# EAGLE design untitled (EAGLE 7.1.0)
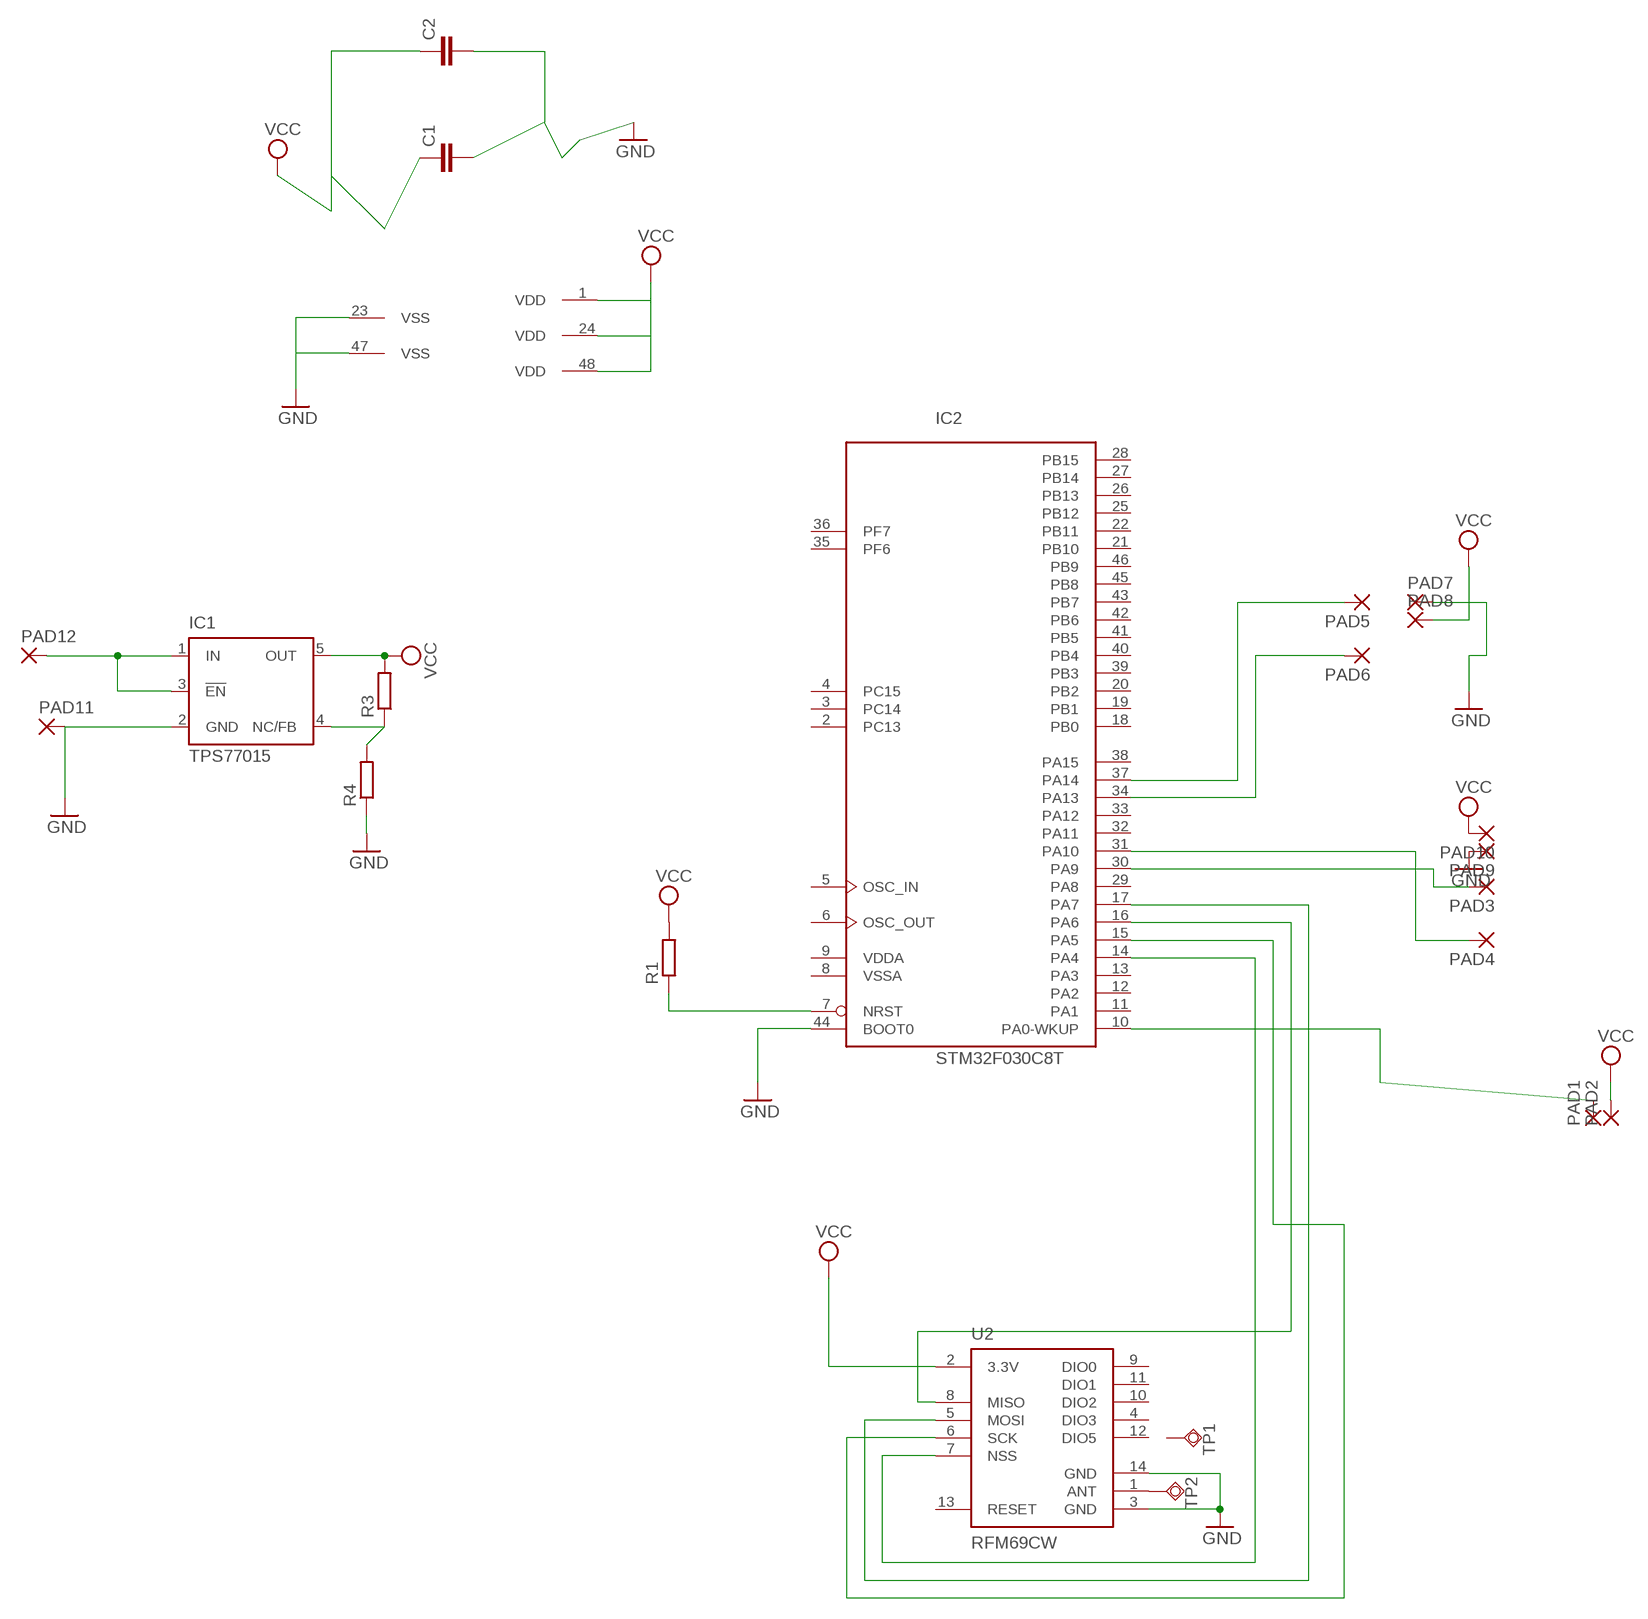
[diagram p0: schematic, sheet 1]

## Parts
C1  C-EUC1206  [C1206]
C2  C-EUC1206  [C1206]
IC1  TPS77015  [SOT23-DBV]
IC2  STM32F030C8T  [LQFP48]
PAD1  SMD2  [SMD1,27-2,54]
PAD2  SMD2  [SMD1,27-2,54]
PAD3  SMD2  [SMD1,27-2,54]
PAD4  SMD2  [SMD1,27-2,54]
PAD5  SMD2  [SMD1,27-2,54]
PAD6  SMD2  [SMD1,27-2,54]
PAD7  SMD2  [SMD1,27-2,54]
PAD8  SMD2  [SMD1,27-2,54]
PAD9  SMD2  [SMD1,27-2,54]
PAD10  SMD2  [SMD1,27-2,54]
PAD11  SMD2  [SMD1,27-2,54]
PAD12  SMD2  [SMD1,27-2,54]
R1  R-EU_M1206  [M1206]
R3  R-EU_M0805  [M0805]
R4  R-EU_M0805  [M0805]
TP1  TPSQTP20SQ  [TP20SQ]
TP2  TPSQTP20SQ  [TP20SQ]
U2  RFM69CW  [RFM69CW-XXXS2]

## Nets
GND: C1.2 C2.2 IC1.2(GND) IC2.23(VSS) IC2.44(BOOT0) IC2.47(VSS) PAD7.1(P) PAD9.1(P) PAD11.1(P) R4.1 U2.3(GND) U2.14(GND)
N$1: IC2.7(NRST) R1.1
N$2: IC2.37(PA14) PAD5.1(P)
N$3: IC2.16(PA6) U2.8(MISO)
N$4: IC2.14(PA4) U2.7(NSS)
N$5: TP2.TP U2.1(ANT)
N$6: IC2.17(PA7) U2.5(MOSI)
N$7: IC2.34(PA13) PAD6.1(P)
N$8: IC2.30(PA9) PAD3.1(P)
N$9: IC2.31(PA10) PAD4.1(P)
N$11: IC2.10(PA0-WKUP) PAD1.1(P)
N$12: IC1.1(IN) IC1.3(!EN) PAD12.1(P)
N$13: IC2.15(PA5) U2.6(SCK)
N$14: IC1.4(NC/FB) R3.1 R4.2
VCC: C1.1 C2.1 IC1.5(OUT) IC2.1(VDD) IC2.24(VDD) IC2.48(VDD) PAD2.1(P) PAD8.1(P) PAD10.1(P) R1.2 R3.2 U2.2(3.3V)
Unconnected: IC2.2(PC13) IC2.3(PC14) IC2.4(PC15) IC2.5(OSC_IN) IC2.6(OSC_OUT) IC2.11(PA1) IC2.12(PA2) IC2.13(PA3) IC2.18(PB0) IC2.19(PB1) IC2.20(PB2) IC2.21(PB10) IC2.22(PB11) IC2.25(PB12) IC2.26(PB13) IC2.27(PB14) IC2.28(PB15) IC2.29(PA8) IC2.32(PA11) IC2.33(PA12) IC2.35(PF6) IC2.36(PF7) IC2.38(PA15) IC2.39(PB3) IC2.40(PB4) IC2.41(PB5) IC2.42(PB6) IC2.43(PB7) IC2.45(PB8) IC2.46(PB9) TP1.TP U2.4(DIO3) U2.9(DIO0) U2.10(DIO2) U2.11(DIO1) U2.12(DIO5) U2.13(RESET)

## Power pins joined to a net without a drawn wire
VDDA: IC2.9(VDDA)
VSSA: IC2.8(VSSA)

## Library data of the parts
C1 C2 = rcl:C-EU: CAPACITOR, European symbol
IC1 = texas:TPS770*: ULTRALOW-POWER 50-mA LOW-DROPOUT LINEAR REGULATORS 50-mA Low-Dropout Regulator Source: http://focus.ti.com/lit/ds/symlink/tps77001.pdf; MF: TEXAS INSTRUMENT CONNECTORS; MPN: TPS77015DBVT; OC_FARNELL: 1412879; OC_NEWARK: 77C1175
IC2 = micro-stm_v2:STM32F030C*T: ARM 32-bit Cortex™-M0 CPU 48 MHz maximum frequency 32 to 64 Kbytes of Flash memory 4 to 8 kbytes of SRAM 39 GPIOs 2.4 to 3.6 V application supply
PAD1-PAD12 = wirepad:SMD2: SMD PAD
R1 R3 R4 = rcl:R-EU_: RESISTOR, European symbol
TP1 TP2 = testpad:TPSQ: Test pad
U2 = mike-temp:RFM69

## Board
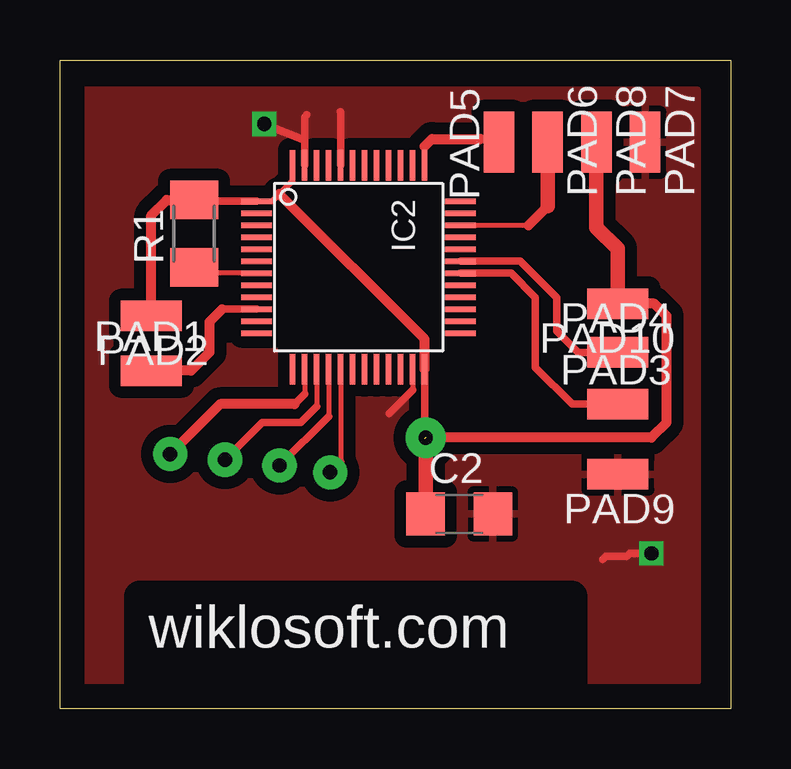
[diagram p1: board, top side]
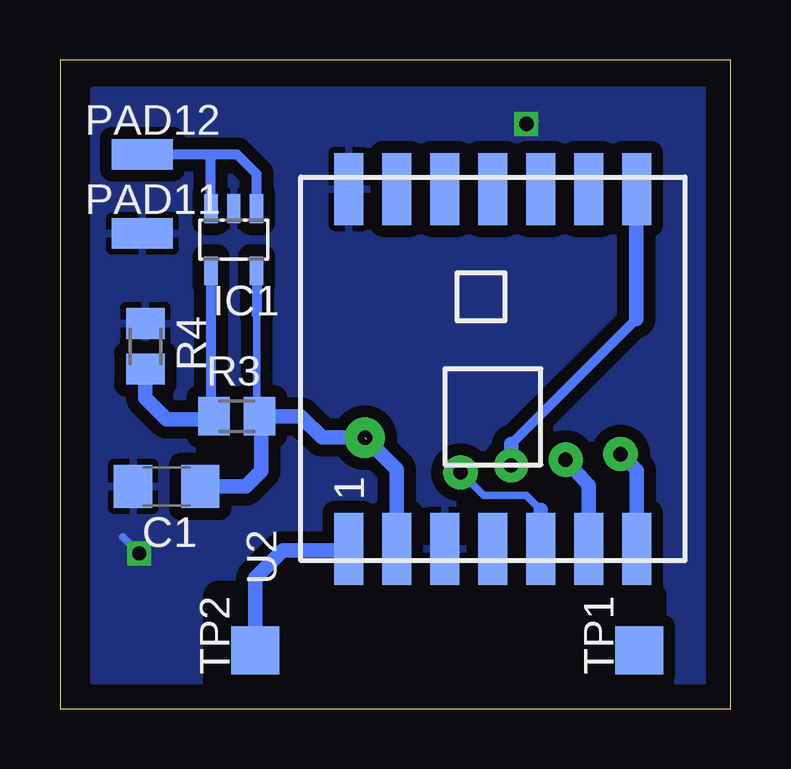
[diagram p2: board, bottom side, seen from below]

Size 27.94 x 27.05 mm. Coordinates in mm from the lower left corner, seen from the top.
Outline: 0,27.05 27.94,27.05 27.94,0 0,0 0,27.05
Copper layers (1*16): Top 0.035mm / dielectric 1.5mm / Bottom 0.035mm
Design rules "default": minimum track width 10mil, minimum drill 24mil, track to track 8mil, track to pad 8mil, pad to pad 8mil, via to via 8mil, smd to smd 8mil, copper to edge 40mil, drill to drill 8mil, minimum pad ring 10mil, minimum via ring 8mil, stop-mask expansion 4mil, vias tented up to drill 0mil, thermal gap 10mil
tRestrict: area 3.3,1.2 to 21.3,4.7
bRestrict: area 3.3,1.2 to 21.3,4.7

### Footprints (pad centres in the part's own frame; a part is rotated, then mirrored left to right if it is on the bottom)
C1206 = smd 1.6 x 1.8: 1 -1.4,0; 2 1.4,0
SOT23-DBV = smd 0.55 x 1.2: 1 -0.95,-1.3; 2 0,-1.3; 3 0.95,-1.3; 4 0.95,1.3; 5 -0.95,1.3
LQFP48 = smd 0.229 x 1.27: 1 -2.75,-4.25; 2 -2.25,-4.25; 3 -1.75,-4.25; 4 -1.25,-4.25; 5 -0.75,-4.25; 6 -0.25,-4.25; 7 0.25,-4.25; 8 0.75,-4.25; 9 1.25,-4.25; 10 1.75,-4.25; 11 2.25,-4.25; 12 2.75,-4.25; 25 2.75,4.25; 26 2.25,4.25; 27 1.75,4.25; 28 1.25,4.25; 29 0.75,4.25; 30 0.25,4.25; 31 -0.25,4.25; 32 -0.75,4.25; 33 -1.25,4.25; 34 -1.75,4.25; 35 -2.25,4.25; 36 -2.75,4.25 | smd 1.27 x 0.229: 13 4.25,-2.75; 14 4.25,-2.25; 15 4.25,-1.75; 16 4.25,-1.25; 17 4.25,-0.75; 18 4.25,-0.25; 19 4.25,0.25; 20 4.25,0.75; 21 4.25,1.25; 22 4.25,1.75; 23 4.25,2.25; 24 4.25,2.75; 37 -4.25,2.75; 38 -4.25,2.25; 39 -4.25,1.75; 40 -4.25,1.25; 41 -4.25,0.75; 42 -4.25,0.25; 43 -4.25,-0.25; 44 -4.25,-0.75; 45 -4.25,-1.25; 46 -4.25,-1.75; 47 -4.25,-2.25; 48 -4.25,-2.75
SMD1,27-2,54 = smd 1.27 x 2.54: 1 0,0
M1206 = smd 1.6 x 2: 1 -1.4,0; 2 1.4,0
M0805 = smd 1.3 x 1.6: 1 -0.95,0; 2 0.95,0
TP20SQ = smd 2 x 2: TP 0,0
RFM69CW-XXXS2 = smd 3 x 1.2: 1 -7.5,6; 2 -7.5,4; 3 -7.5,2; 4 -7.5,0; 5 -7.5,-2; 6 -7.5,-4; 7 -7.5,-6; 8 7.5,-6; 9 7.5,-4; 10 7.5,-2; 11 7.5,0; 12 7.5,2; 13 7.5,4; 14 7.5,6

### Placement (x,y rotation side)
C1  23.5,9.27 180 bottom
C2  16.64,8.13 0 top
IC1  20.7,19.56 180 bottom
IC2  12.45,18.41 270 top
PAD1  3.81,14.1 270 top
PAD2  3.81,16.38 90 top
PAD3  23.24,12.7 270 top
PAD4  23.24,14.86 270 top
PAD5  18.29,23.62 0 top
PAD6  20.32,23.62 180 top
PAD7  24.38,23.62 180 top
PAD8  22.35,23.62 180 top
PAD9  23.24,9.78 90 top
PAD10  23.24,16.89 90 top
PAD11  24.51,19.81 270 bottom
PAD12  24.51,23.11 270 bottom
R1  5.59,19.81 90 top
R3  20.57,12.19 0 bottom
R4  24.38,15.11 270 bottom
TP1  3.81,2.43 90 bottom
TP2  19.81,2.43 90 bottom
U2  9.91,14.18 90 bottom

### Tracks (layer width: path | path; a pad name or v marks a point on that pad's centre or on a via)
GND  (via drill 0.6)
  Top 0.203: IC2.23 14.7,13.3
  Top 0.305: 14.7,13.3 13.72,12.32 | 10.2,23.71 v8.51,24.38 | v24.64,6.48 23.75,6.48 23.62,6.35 22.73,6.35 22.61,6.22 | IC2.47 10.2,24.67 10.29,24.77 | IC2.44 11.7,24.88 11.68,24.89
  Bottom 0.305: v8.51,24.38 8.13,24.51 | 25.33,7.17 v24.64,6.48
  pour Top (isolate 0.5): 1.02,25.78 1.02,1.14 26.54,1.14 26.54,25.78
  pour Bottom (isolate 0.5): 1.02,25.78 26.54,25.78 26.54,1.14 1.02,1.14
N$1
  Top 0.203: IC2.7 5.72,18.16
  Top 0.305: 5.72,18.16 R1.1
N$2
  Top 0.203: 17.97,22.66 PAD5.1 | IC2.37 15.2,23.45
  Top 0.305: 17.53,23.75 PAD5.1
  Top 0.406: 15.2,23.45 15.49,23.75 17.53,23.75
N$3  (via drill 0.6 pad 1.42)
  Top 0.203: IC2.16 11.2,12.2
  Top 0.305: v9.14,10.14 11.2,12.2
  Bottom 0.305: 3.94,20.87 U2.8
  Bottom 0.406: 9.14,11.03 3.94,16.24
  Bottom 0.61: v9.14,10.14 9.14,11.03 | 3.94,16.24 3.94,20.87
N$4  (via drill 0.6 pad 1.42)
  Top 0.203: IC2.14 10.2,13.12
  Top 0.305: 10.2,13.12 9.78,12.7
  Top 0.406: 9.78,12.7 6.67,12.7 v4.59,10.62
  Bottom 0.305: 4.57,10.67 4.57,10.73 v4.59,10.62
  Bottom 0.61: U2.7 3.91,9.94 4.57,10.67
N$5
  Bottom 0.305: 15.98,6.6 U2.1
  Bottom 0.61: TP2.TP 19.81,5.46 18.67,6.6 15.98,6.6
N$6  (via drill 0.6 pad 1.42)
  Top 0.203: IC2.17 11.7,10.3
  Top 0.305: 11.7,10.3 v11.26,9.86
  Bottom 0.305: v11.26,9.86 10.29,8.89 8.51,8.89 7.91,8.29
  Bottom 0.61: U2.5 7.91,8.29
N$7
  Top 0.203: IC2.34 19.53,20.16
  Top 0.406: 19.53,20.16 20.32,20.95
  Top 0.61: 20.32,20.95 PAD6.1
N$8
  Top 0.305: PAD3.1 21.34,12.7 19.81,14.22 19.81,17.14 18.79,18.16 IC2.30
N$9
  Top 0.305: IC2.31 19.18,18.66 20.7,17.14 20.7,15.75 21.59,14.86 PAD4.1
N$11
  Top 0.305: IC2.10 6.76,16.66
  Top 0.406: 6.76,16.66 6.22,16.13 6.22,14.86 5.46,14.1 PAD1.1
N$12
  Bottom 0.406: PAD12.1 21.84,23.11 | 21.84,23.11 20.57,23.11 19.75,22.29 IC1.1 | IC1.3 21.65,22.92 21.84,23.11
N$13  (via drill 0.6 pad 1.42)
  Top 0.203: IC2.15 10.7,12.6
  Top 0.305: 10.7,12.6 10.03,11.94 8.43,11.94 v6.87,10.38
  Bottom 0.61: U2.6 5.91,9.32 v6.87,10.38
N$14
  Bottom 0.406: IC1.4 21.65,12.32 R3.1 21.65,12.07
  Bottom 0.61: 21.65,12.07 23.5,12.07 24.38,12.95 R4.2
VCC  (via drill 0.6 pad 1.68)  (1 unrouted)
  Top 0.203: IC2.1 8.85,21.16 | IC2.48 9.7,22.02
  Top 0.254: 8.85,21.16 9.14,21.46 9.7,22.02
  Top 0.305: IC2.1 5.63,21.16 R1.2 | IC2.24 15.2,11.35 v15.24,11.3
  Top 0.406: IC2.24 15.2,15.41 9.14,21.46 | PAD10.1 24.77,16.89 25.27,16.38 25.27,11.94 24.64,11.3 v15.24,11.3 | PAD2.1 3.81,20.57 4.45,21.21 R1.2
  Top 0.61: PAD8.1 22.35,20.07 23.24,19.18 PAD10.1 | C2.1 v15.24,11.3
  Bottom 0.305: 19.75,16.45 19.75,12.32 R3.2
  Bottom 0.406: IC1.5 19.75,16.45 | 19.56,12.13 R3.2
  Bottom 0.61: U2.2 13.91,9.97 15.18,11.24 | C1.1 20.19,9.27 19.56,9.91 19.56,12.13 | v15.24,11.3 17.02,11.3 17.91,12.19 R3.2

### Text on the board
tNames: wiklosoft.com